# Altium project MainBoard.PrjPcb
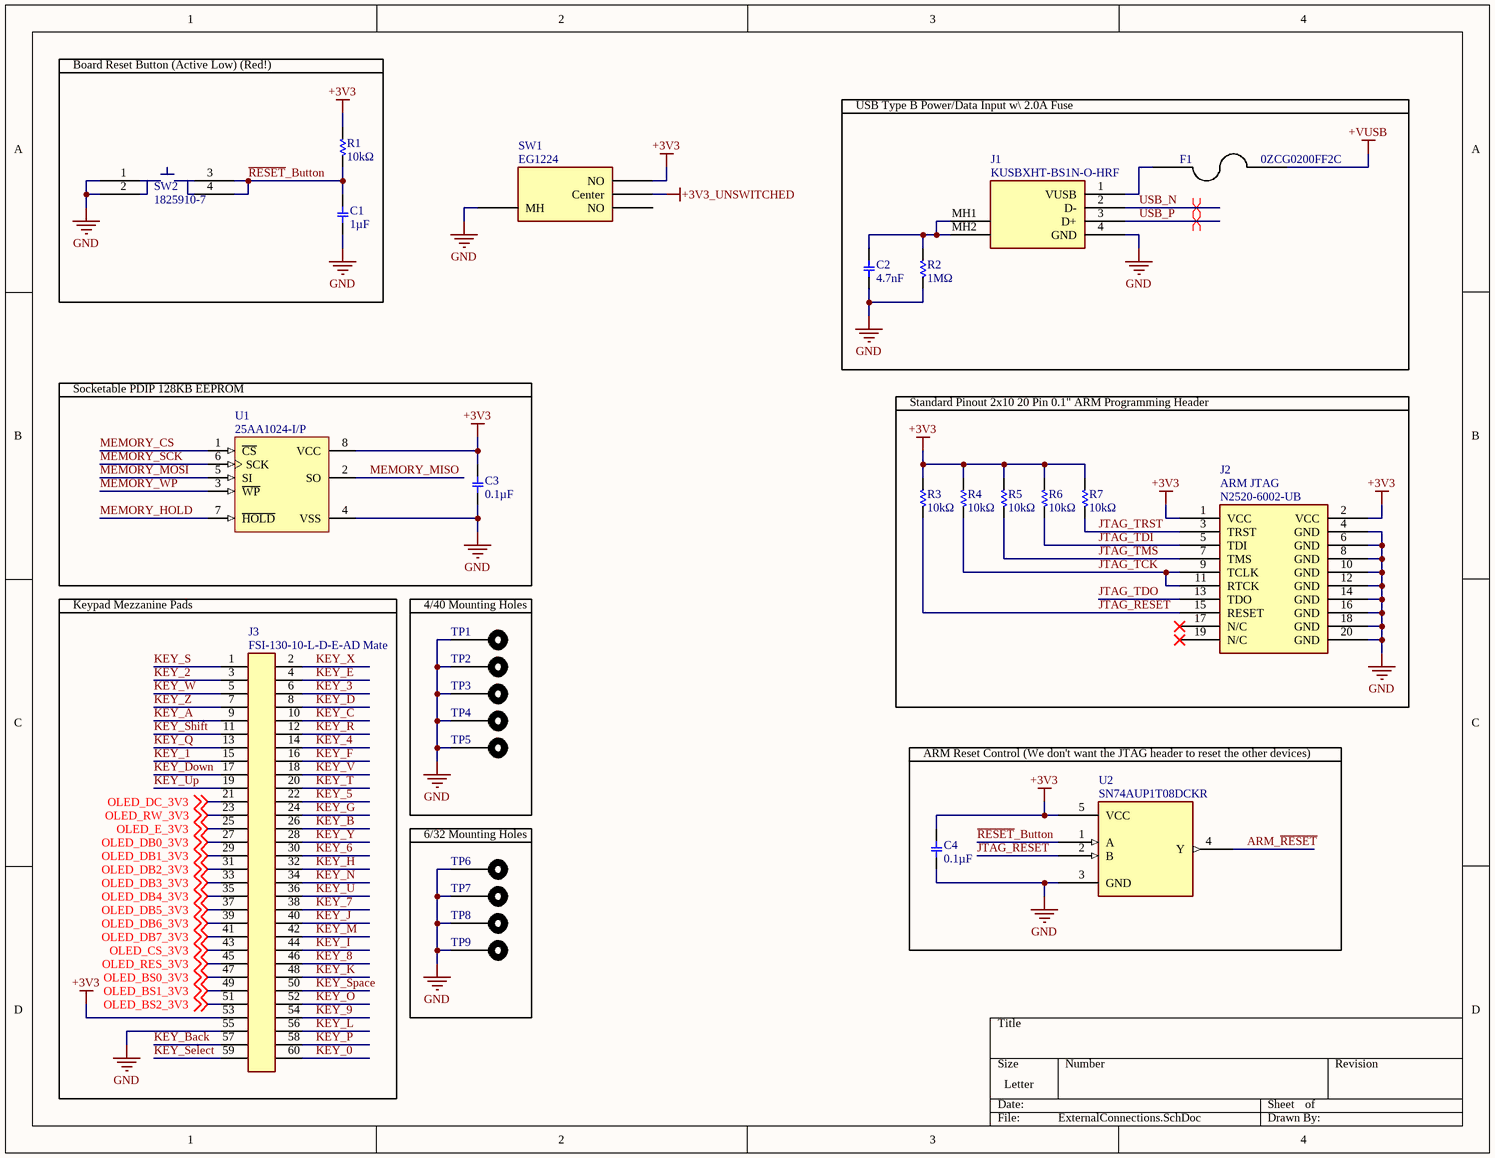
[diagram p0: ExternalConnections.SchDoc]
4 sheets, 88 parts. Net scope: global (net labels, ports and power ports of the same name join across sheets).
Board file: MainBoard.PcbDoc
Sheets:
  ExternalConnections.SchDoc
  USB.SchDoc
  Microcontroller.SchDoc
  Power.SchDoc

## Sheet ExternalConnections.SchDoc
size Letter

### Parts
C1  1µF  [C0805(2012)_NP_med]
C2  4.7nF  [C0805(2012)_NP_med]
C3  0.1µF  [C0805(2012)_NP_med]
C4  0.1µF  [C0805(2012)_NP_med]
F1  Manufacturer Part Number: 0ZCG0200FF2C  [C1812(4532)_NP_med]  (hidden comment: Bel 0ZCG0200FF2C)
J1  KUSBXHT-BS1N-O-HRF  [Kycon KUSBXHT-BS1N-O-HRF]
J2  ARM JTAG  Manufacturer Part Number: N2520-6002-UB  [3M 2520-6002UB]
J3  FSI-130-10-L-D-E-AD Mate  [FSI-130-10-L-D-E-AD - Mate]  (no BOM)
R1  10kΩ  [R0805(2012)_med]
R2  1MΩ  [R0805(2012)_med]
R3  10kΩ  [R0805(2012)_med]
R4  10kΩ  [R0805(2012)_med]
R5  10kΩ  [R0805(2012)_med]
R6  10kΩ  [R0805(2012)_med]
R7  10kΩ  [R0805(2012)_med]
SW1  Manufacturer Part Number: EG1224  [E-Switch EG1224]  (hidden comment: E-Switch EG1224)
SW2  1825910-7  [TE 1825910-6]
TP1  Testpoint  [4-40 HOLE]  (value not drawn)
TP2  Testpoint  [4-40 HOLE]  (value not drawn)
TP3  Testpoint  [4-40 HOLE]  (value not drawn)
TP4  Testpoint  [4-40 HOLE]  (value not drawn)
TP5  Testpoint  [4-40 HOLE]  (value not drawn)
TP6  Testpoint  [6-32 Hole]  (value not drawn)
TP7  Testpoint  [6-32 Hole]  (value not drawn)
TP8  Testpoint  [6-32 Hole]  (value not drawn)
TP9  Testpoint  [6-32 Hole]  (value not drawn)
U1  25AA1024-I/P  [PDIP300-P8]
U2  Manufacturer Part Number: SN74AUP1T08DCKR  [TI 5 Pin DCK (R-PDSO-G5)]  (hidden comment: TI SN74AUP1T08DCKR)

### Blocks framed on the sheet
Board Reset Button (Active Low) (Red!): C1 R1 SW2
USB Type B Power/Data Input w\ 2.0A Fuse: C2 F1 J1 R2
Socketable PDIP 128KB EEPROM: C3 U1
Standard Pinout 2x10 20 Pin 0.1" ARM Programming Header: J2 R3-R7
Keypad Mezzanine Pads: J3
4/40 Mounting Holes: TP1-TP5
6/32 Mounting Holes: TP6-TP9

### Nets
+3V3: C3.1 C4.1 J2.1(VCC) J2.2(VCC) J3.53 R1.1 R3.1 R4.1 R5.1 R6.1 R7.1 SW1.1(NO) U1.8(VCC) U2.5(VCC)
+3V3_UNSWITCHED: SW1.2(Center)
+VUSB: F1.2
GND: C1.2 C2.2 C3.2 C4.2 J1.4(GND) J2.4(GND) J2.6(GND) J2.8(GND) J2.10(GND) J2.12(GND) J2.14(GND) J2.16(GND) J2.18(GND) J2.20(GND) J3.55 R2.2 SW1.4(MH) SW2.1 SW2.2 TP1.1 TP2.1 TP3.1 TP4.1 TP5.1 TP6.1 TP7.1 TP8.1 TP9.1 U1.4(VSS) U2.3(GND)
ARM_~{RESET}: U2.4(Y)
JTAG_~{RESET}: J2.15(RESET) R3.2 U2.2(B)
JTAG_TCK: J2.9(TCLK) J2.11(RTCK) R4.2
JTAG_TDI: J2.5(TDI) R6.2
JTAG_TDO: J2.13(TDO)
JTAG_TMS: J2.7(TMS) R5.2
JTAG_TRST: J2.3(TRST) R7.2
KEY_0: J3.60
KEY_1: J3.15
KEY_2: J3.3
KEY_3: J3.6
KEY_4: J3.14
KEY_5: J3.22
KEY_6: J3.30
KEY_7: J3.38
KEY_8: J3.46
KEY_9: J3.54
KEY_A: J3.9
KEY_B: J3.26
KEY_Back: J3.57
KEY_C: J3.10
KEY_D: J3.8
KEY_Down: J3.17
KEY_E: J3.4
KEY_F: J3.16
KEY_G: J3.24
KEY_H: J3.32
KEY_I: J3.44
KEY_J: J3.40
KEY_K: J3.48
KEY_L: J3.56
KEY_M: J3.42
KEY_N: J3.34
KEY_O: J3.52
KEY_P: J3.58
KEY_Q: J3.13
KEY_R: J3.12
KEY_S: J3.1
KEY_Select: J3.59
KEY_Shift: J3.11
KEY_Space: J3.50
KEY_T: J3.20
KEY_U: J3.36
KEY_Up: J3.19
KEY_V: J3.18
KEY_W: J3.5
KEY_X: J3.2
KEY_Y: J3.28
KEY_Z: J3.7
MEMORY_CS: U1.1(~{CS})
MEMORY_HOLD: U1.7(~{HOLD})
MEMORY_MISO: U1.2(SO)
MEMORY_MOSI: U1.5(SI)
MEMORY_SCK: U1.6(SCK)
MEMORY_WP: U1.3(~{WP})
OLED_BS0_3V3: J3.47 ; off-sheet OLED_BS0_3V3
OLED_BS1_3V3: J3.49 ; off-sheet OLED_BS1_3V3
OLED_BS2_3V3: J3.51 ; off-sheet OLED_BS2_3V3
OLED_CS_3V3: J3.43 ; off-sheet OLED_CS_3V3
OLED_DB0_3V3: J3.27 ; off-sheet OLED_DB0_3V3
OLED_DB1_3V3: J3.29 ; off-sheet OLED_DB1_3V3
OLED_DB2_3V3: J3.31 ; off-sheet OLED_DB2_3V3
OLED_DB3_3V3: J3.33 ; off-sheet OLED_DB3_3V3
OLED_DB4_3V3: J3.35 ; off-sheet OLED_DB4_3V3
OLED_DB5_3V3: J3.37 ; off-sheet OLED_DB5_3V3
OLED_DB6_3V3: J3.39 ; off-sheet OLED_DB6_3V3
OLED_DB7_3V3: J3.41 ; off-sheet OLED_DB7_3V3
OLED_DC_3V3: J3.21 ; off-sheet OLED_DC_3V3
OLED_E_3V3: J3.25 ; off-sheet OLED_E_3V3
OLED_RES_3V3: J3.45 ; off-sheet OLED_RES_3V3
OLED_RW_3V3: J3.23 ; off-sheet OLED_RW_3V3
~{RESET}_Button: C1.1 R1.2 SW2.3 SW2.4 U2.1(A)
USB_N: J1.2(D-)
USB_P: J1.3(D+)
NetC2_1: C2.1 J1.MH1 J1.MH2 R2.1
NetF1_1: F1.1 J1.1(VUSB)

Not connected (* = marked no-connect by the designer): J2 17(N/C)* 19(N/C)*; SW1 3(NO)

### Layout directives
differential pair: USB_N, USB_P

### Notes on the sheet
- ARM Reset Control (We don't want the JTAG header to reset the other devices)

### Library data of the parts
C1-C4 = CPN_SMT: SMT Capacitor; Tolerance: X7R; Rating: 16v
  C1: Value: 1µF
  C2: Value: 4.7nF
  C3 C4: Value: 0.1µF
F1 = Bel 0ZCG0200FF2C: PTC RESTTBLE 2.0A 8V CHIP 1812; Manufacturer: Bel Fuse Inc.; Current - Max: 100A; Current - Hold (Ih) (Max): 2A; Current - Trip (It): 3.5A; R Min/Max: 0.020 ~ 0.070 Ohm; Time to Trip: 2s; Supplier 1: Digi-Key; RoHS: RoHS Compliant; Category: Circuit Protection; Stock 1: 4721; Pricing 1: 1=0.18, 10=0.169, 25=0.156, 100=0.1401, 250=0.12476, 500=0.10396, 1000=0.09851 (USD); Packaging: Cut Tape (CT); Voltage - Max: 8V; Package / Case: 1812 (4532 Metric), Concave; ComponentLink1URL: http://www.belfuse.com/pdfs/0ZCG.pdf; ComponentLink1Description: http://www.belfuse.com/pdfs/0ZCG.pdf; Supplier Part Number 1: 507-1777-1-ND
J1 = Kycon KUSBXHT-BS1N-O-HRF: TYPE B ORANGE HIGH TEMP/RETENTION; Manufacturer: Kycon; Connector Type: USB Type B Receptacle; Current Rating: 1 A; Gender: Female; Mounting Angle: Right; Number of Contacts: 4 Contact; Voltage Rating: 30 VAC; Number of Ports: 1 Port; Insulation Resistance: 1000 MOhms; Supplier 1: Mouser; Manufacturer Part Number: KUSBXHT-BS1N-O-HRF; RoHS: RoHS Compliant; Category: USB Connectors; Stock 1: 2882; Pricing 1: 1=2.06, 25=1.73, 100=1.51, 500=1.34, 1000=1.20, 5000=1.11, 10000=1.02 (USD); Color: Orange; Contact Plating: Gold; Operating Temperature Range: - 25 C to + 80 C; Packaging: Tray; Product: USB Type B Connectors; Series: KUSBXHT; Termination Style: Solder; Brand: Kycon; Contact Material: Phosphor Bronze; Flammability Rating: UL 94 V-0; Insulator Color: Orange; Product Category: USB Connectors; Standard: USB; Standard Pack Qty: 36; RoHS - Mouser: Y; Minimum Order Quantity: 1; Reeling: False; ComponentLink1URL: http://www.mouser.com/ds/2/222/KUSBX-371999.pdf; ComponentLink1Description: http://www.mouser.com/ds/2/222/KUSBX-371999.pdf
J2 = 20-Pin ARM JTAG Programming Header: Standard 20-Pin Pinout; Manufacturer: 3M; Connector Type: Header, Shrouded; Number of Positions: 20; Number of Positions Loaded: All; Pitch: 0.100" (2.54mm); Supplier 1: Digi-Key; RoHS: RoHS Compliant; Category: Connectors, Interconnects; Stock 1: 0; Pricing 1: 1008=2.059 (USD); Packaging: Bulk; Contact Type: Male Pin; Number of Rows: 2; Row Spacing: 0.100" (2.54mm); Contact Mating Length: 0.243" (6.17mm); Mounting Type: Through Hole; Termination: Solder; Fastening Type: -; Features: -; Contact Finish: Gold; Contact Finish Thickness: 30µin (0.76µm); Color: Black; ComponentLink1URL: http://multimedia.3m.com/mws/mediawebserver?66666UuZjcFSLXTtMXM6MxfcEVuQEcuZgVs6EVs6E666666--; ComponentLink1Description: http://multimedia.3m.com/mws/mediawebserver?66666UuZjcFSLXTtMXM6MxfcEVuQEcuZgVs6EVs6E666666--
J3 = Samtec FSI-130-10-L-D-E-AD Mate: CONN INTERFACE ONE PC 1MM 60POS
R1-R7 = RES_SMT: SMT resistor; Tolerance: 1%
  R1 R3-R7: Value: 10kΩ
  R2: Value: 1MΩ
SW1 = E-Switch EG1224: SWITCH SLIDE SPDT 500MA 15V; Contact Timing: Non-Shorting (BBM); Switch Function: On-On; Current Rating: 500mA (DC); Actuator Type: Standard; Actuator Length: 8.50mm; Switch Travel: 4.00mm; Operating Force: 250gf; Supplier 1: Digi-Key; Manufacturer: E-Switch; RoHS: RoHS Compliant; Category: Switches; Stock 1: 3595; Pricing 1: 1=0.73, 10=0.698, 25=0.684, 50=0.6112, 100=0.582, 250=0.56744, 500=0.48016, 1000=0.4656 (USD); Packaging: Bulk; Circuit: SPDT; Voltage Rating - AC: -; Voltage Rating - DC: 15V; Contact Material: Copper Alloy; Contact Finish: Silver; Mounting Type: Through Hole, Right Angle; Termination Style: PC Pin; Features: -; Actuator Material: -; Operating Temperature: -20°C ~ 70°C; Mechanical Life: -; Electrical Life: -; ComponentLink1URL: http://spec_sheets.e-switch.com/specs/P040042.pdf; ComponentLink1Description: http://spec_sheets.e-switch.com/specs/P040042.pdf; Supplier Part Number 1: EG2585-ND
SW2 = TE 1825910-6: SWITCH TACTILE SPST-NO 0.05A 24V; Manufacturer: TE Connectivity Alcoswitch Switches; Switch Function: Off-Mom; Contact Rating @ Voltage: 0.05A @ 24VDC; Actuator Type: Standard; Actuator Height off PCB, from Pins: 5.00mm; Actuator Orientation: Top Actuated; Outline: 6.00mm x 6.00mm; Illumination: Non-Illuminated; Operating Force: 160gf; Actuator Material: Polybutylene Terephthalate (PBT); Switch Travel: 0.25mm; Mechanical Life: 100,000 Cycles; Supplier 1: Digi-Key; Manufacturer Part Number: 1825910-6; RoHS: RoHS Compliant; Category: Switches; Stock 1: 68158; Pricing 1: 1=0.11, 25=0.1012, 50=0.0912, 100=0.0869, 250=0.08028, 500=0.07698, 1000=0.06268, 2000=0.05609, 5000=0.05278 (USD); Packaging: Bulk; Circuit: SPST-NO; Mounting Type: Through Hole; Termination Style: PC Pin; Illumination Voltage (Nominal): -; Illumination Type, Color: -; Ingress Protection: -; Features: -; Operating Temperature: -35°C ~ 85°C; ComponentLink1URL: http://www.te.com/commerce/DocumentDelivery/DDEController?Action=srchrtrv&DocNm=1825910&DocType=Customer+Drawing&DocLang=English; ComponentLink1Description: http://www.te.com/commerce/DocumentDelivery/DDEController?Action=srchrtrv&DocNm=1825910&DocType=Customer+Drawing&DocLang=English
U1 = 25AA1024-I/P: 1 Mbit SPI Bus Serial EEPROM, 8-Pin PDIP, Industrial Temperature; Manufacturer: Microchip; DatasheetVersion: revF, May-2008; PackageVersion: revBB, Aug-2009; PackageReference: PDIP300-P8; PackageDescription: 8-Lead Plastic Dual In-Line (P) - 300 mil Body [PDIP]; Supplier 1: Digi-Key; Supplier Part Number 1: 25AA1024-I/P-ND; Supplier 2: Farnell; Supplier Part Number 2: 1548441; Supplier 3: Newark; Supplier Part Number 3: 89H3144; Supplier 4: Mouser; Supplier Part Number 4: 579-25AA1024-I/P; Mounting Technology: Through Hole; Code_JEDEC: MS-001; PartNumber: 25AA1024-I/P; ComponentLink1Description: Manufacturer URL; ComponentLink1URL: http://www.microchip.com/; ComponentLink2Description: Datasheet; ComponentLink2URL: http://ww1.microchip.com/downloads/en/DeviceDoc/21836F.pdf; ComponentLink3Description: Package Specification; ComponentLink3URL: http://www.microchip.com/stellent/groups/techpub_sg/documents/packagingspec/en012702.pdf
U2 = TI SN74AUP1T08DCKR: IC GATE AND 1CH 2-INP SC-70-5; Manufacturer: Texas Instruments; Logic Type: AND Gate; Number of Circuits: 1; Number of Inputs: 2; Voltage - Supply: 2.3 V ~ 3.6 V; Current - Quiescent (Max): 0.5µA; Current - Output High, Low: 4mA, 4mA; Logic Level - Low: 0.35 V ~ 0.5 V; Logic Level - High: 1.1 V ~ 1.19 V; Max Propagation Delay @ V, Max CL: 4.4ns @ 3.3V, 30pF; Supplier 1: Digi-Key; RoHS: RoHS Compliant; Category: Integrated Circuits (ICs); Stock 1: 3783; Pricing 1: 1=0.36, 10=0.29, 100=0.198, 500=0.1482, 1000=0.111 (USD); Packaging: Cut Tape (CT); Features: Schmitt Trigger; Operating Temperature: -40°C ~ 85°C; Mounting Type: Surface Mount; Supplier Device Package: SC-70-5; Package / Case: 5-TSSOP, SC-70-5, SOT-353; ComponentLink1URL: http://www.ti.com/lit/ds/symlink/sn74aup1t08.pdf; ComponentLink1Description: http://www.ti.com/lit/ds/symlink/sn74aup1t08.pdf; Supplier Part Number 1: 296-27391-1-ND

## Sheet USB.SchDoc
size Letter
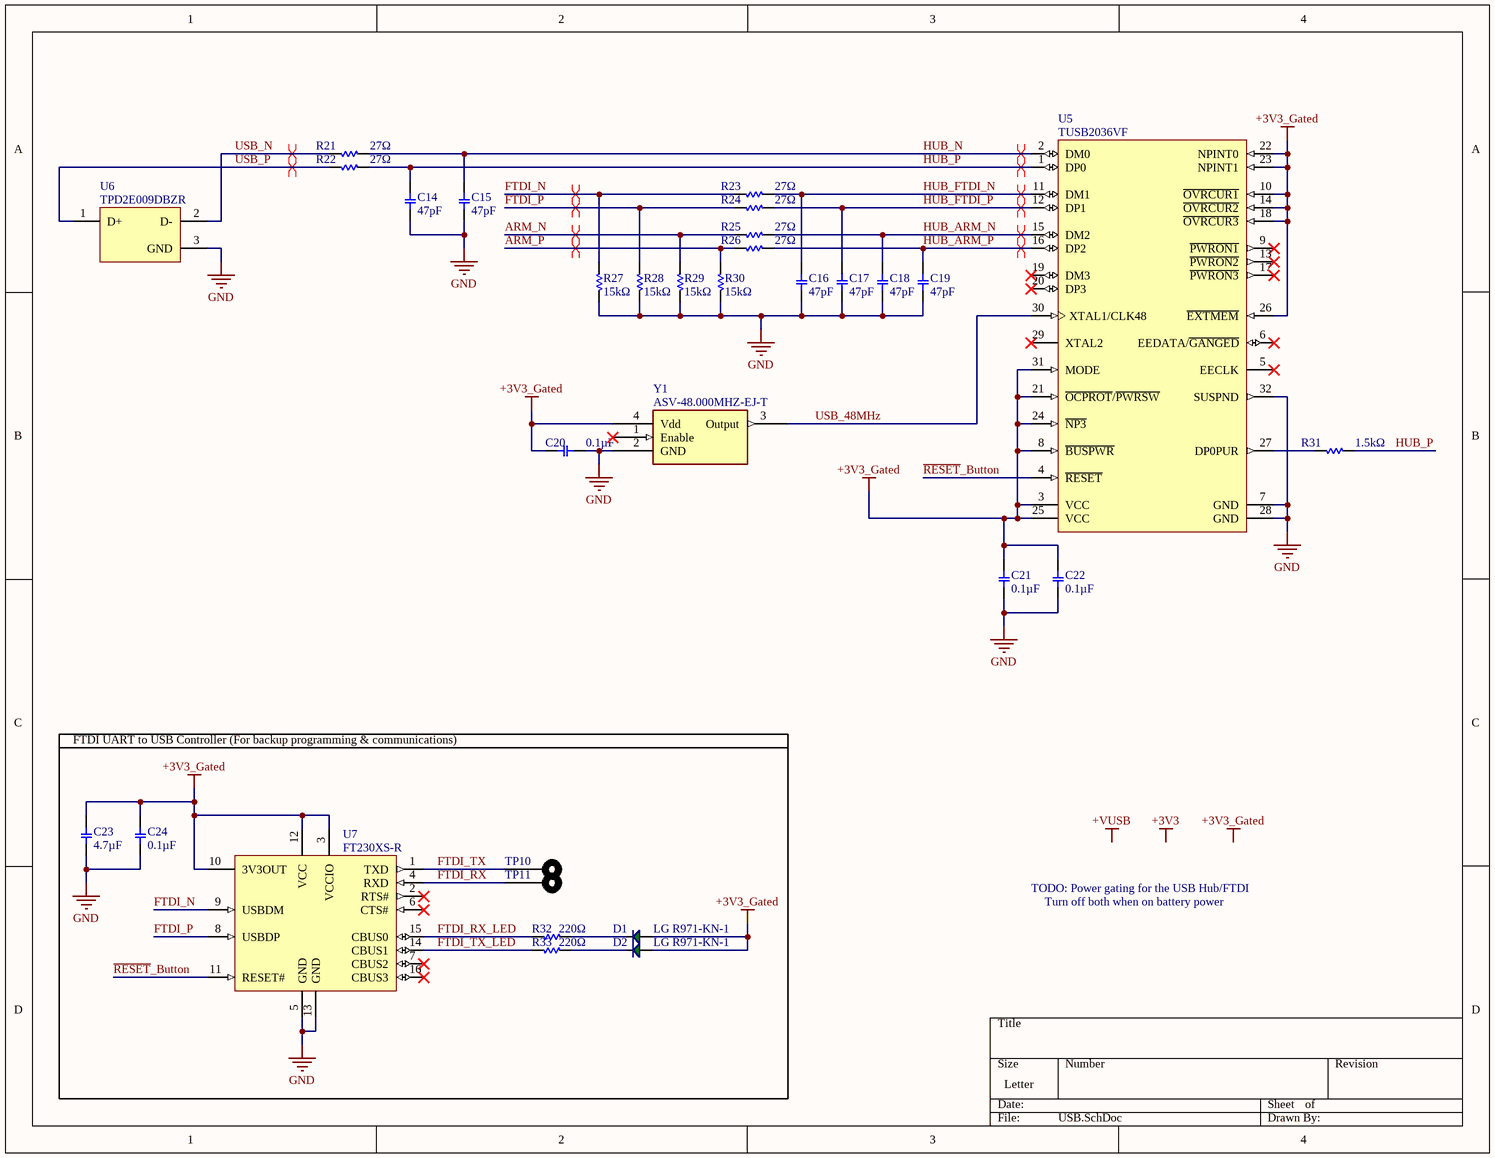
[diagram p1: USB.SchDoc]

### Parts
C14  47pF  [C0805(2012)_NP_med]
C15  47pF  [C0805(2012)_NP_med]
C16  47pF  [C0805(2012)_NP_med]
C17  47pF  [C0805(2012)_NP_med]
C18  47pF  [C0805(2012)_NP_med]
C19  47pF  [C0805(2012)_NP_med]
C20  0.1µF  [C0805(2012)_NP_med]
C21  0.1µF  [C0805(2012)_NP_med]
C22  0.1µF  [C0805(2012)_NP_med]
C23  4.7µF  [C0805(2012)_NP_med]
C24  0.1µF  [C0805(2012)_NP_med]
D1  LG R971-KN-1  [C0805(2012)_P_med]
D2  LG R971-KN-1  [C0805(2012)_P_med]
R21  27Ω  [R0805(2012)_med]
R22  27Ω  [R0805(2012)_med]
R23  27Ω  [R0805(2012)_med]
R24  27Ω  [R0805(2012)_med]
R25  27Ω  [R0805(2012)_med]
R26  27Ω  [R0805(2012)_med]
R27  15kΩ  [R0805(2012)_med]
R28  15kΩ  [R0805(2012)_med]
R29  15kΩ  [R0805(2012)_med]
R30  15kΩ  [R0805(2012)_med]
R31  1.5kΩ  [R0805(2012)_med]
R32  220Ω  [R0805(2012)_med]
R33  220Ω  [R0805(2012)_med]
TP10  Testpoint  [TESTPOINT]  (value not drawn)
TP11  Testpoint  [TESTPOINT]  (value not drawn)
U5  TUSB2036VF  [VF32_M]
U6  TPD2E009DBZR  [DBZ3_N]
U7  FT230XS-R  [SSOP-16_M]
Y1  ASV-48.000MHZ-EJ-T  [Abracon ASV XO]

### Nets
+3V3_Gated: C20.1 C21.1 C22.1 C23.1 C24.1 D1.2(A) D2.2(A) U5.3(VCC) U5.8(~{BUSPWR}) U5.10(~{OVRCUR1}) U5.14(~{OVRCUR2}) U5.18(~{OVRCUR3}) U5.21(~{OCPROT}/~{PWRSW}) U5.22(NPINT0) U5.23(NPINT1) U5.24(~{NP3}) U5.25(VCC) U5.26(~{EXTMEM}) U5.31(MODE) U7.3(VCCIO) U7.10(3V3OUT) U7.12(VCC) Y1.4(Vdd)
GND: C14.2 C15.2 C16.2 C17.2 C18.2 C19.2 C20.2 C21.2 C22.2 C23.2 C24.2 R27.1 R28.1 R29.1 R30.1 U5.7(GND) U5.28(GND) U5.32(SUSPND) U6.3(GND) U7.5(GND) U7.13(GND) Y1.2(GND)
ARM_N: R25.1 R29.2
ARM_P: R26.1 R30.2
FTDI_N: R23.1 R27.2 U7.9(USBDM)
FTDI_P: R24.1 R28.2 U7.8(USBDP)
FTDI_RX: TP11.1 U7.4(RXD)
FTDI_RX_LED: R32.2 U7.15(CBUS0)
FTDI_TX: TP10.1 U7.1(TXD)
FTDI_TX_LED: R33.2 U7.14(CBUS1)
HUB_ARM_N: C18.1 R25.2 U5.15(DM2)
HUB_ARM_P: C19.1 R26.2 U5.16(DP2)
HUB_FTDI_N: C16.1 R23.2 U5.11(DM1)
HUB_FTDI_P: C17.1 R24.2 U5.12(DP1)
HUB_N: C15.1 R21.2 U5.2(DM0)
HUB_P: C14.1 R22.2 R31.2 U5.1(DP0)
~{RESET}_Button: U5.4(~{RESET}) U7.11(RESET#)
USB_48MHz: U5.30(XTAL1/CLK48) Y1.3(Output)
USB_N: R21.1 U6.2(D-)
USB_P: R22.1 U6.1(D+)
NetD1_1: D1.1(K) R32.1
NetD2_1: D2.1(K) R33.1
NetR31_1: R31.1 U5.27(DP0PUR)

Not connected (* = marked no-connect by the designer): U5 5(EECLK)* 6(EEDATA/~{GANGED})* 9(~{PWRON1})* 13(~{PWRON2})* 17(~{PWRON3})* 19(DM3)* 20(DP3)* 29(XTAL2)*; U7 2(RTS#)* 6(CTS#)* 7(CBUS2)* 16(CBUS3)*; Y1 1(Enable)*

### Layout directives
differential pair: ARM_N, ARM_P, FTDI_N, FTDI_P, HUB_ARM_N, HUB_ARM_P, HUB_FTDI_N, HUB_FTDI_P, HUB_N, HUB_P, USB_N, USB_P

### Notes on the sheet
- FTDI UART to USB Controller (For backup programming & communications)
- TODO: Power gating for the USB Hub/FTDI
- Turn off both when on battery power
- Labels drawn without touching a wire or pin: +3V3, +3V3_Gated, +VUSB

### Library data of the parts
C14-C24 = CPN_SMT: as C1 on sheet ExternalConnections
  C14-C19: Value: 47pF
  C20-C22 C24: Value: 0.1µF
  C23: Value: 4.7µF
D1 D2 = DIODE_sMT: SMT LED; Manufacturer: AVX; Part Number: SD0805S020S1R0; Digikey #: 478-7800-1-ND
R21-R33 = RES_SMT: SMT resistor; Tolerance: 1%
  R21-R26: Value: 27Ω
  R27-R30: Value: 15kΩ
  R31: Value: 1.5kΩ
  R32 R33: Value: 220Ω
TP10 TP11 = Testpoint: A single hole in the board
U5 = TUSB2036VF: 2 / 3-Port Hub for USB with Optional Serial EEPROM Interface, 3.3V, 0 to 70 degC, 32-Pin LQFP (VF), Green (RoHS & no Sb/Br); Manufacturer: Texas Instruments; SubFamily: USB Hub Controller; USB Speed: Full; USB Full Speed: True; Supply Voltage(s)(V): 3.3; DatasheetVersion: SLLS372E; PackageVersion: revD, Apr-2000; PackageReference: VF32; PackageDescription: 32-Pin Plastic Quad Flatpack, 7 x 7 mm Body, 0.8 mm Pitch; PartNumber: TUSB2036VF; Mounting Technology: Surface Mount; Eco-Plan: Green (RoHS & no Sb/Br); Integrated MCU Architecture: N/A; ComponentLink1Description: Datasheet; ComponentLink1URL: http://www.ti.com/general/docs/lit/getliterature.tsp?genericPartNumber=TUSB2036&fileType=pdf; ComponentLink2Description: Package Specification; ComponentLink2URL: http://www.ti.com/litv/pdf/mtqf002b
U6 = TPD2E009DBZR: ESD Protection Array for High-Speed Data Interfaces, 2 Channels, -40 to +85 degC, 3-pin SOT-23 (DBZ), Green (RoHS & no Sb/Br); Manufacturer: Texas Instruments; Breakdown Voltage(Min)(V): 9; Differential Capacitance(pF): 0.01; IEC 61000-4-2 Air-Gap(+/- kV): 8; IO Capacitance(Typ)(pF): 0.7; IO Leakage Current(nA): 10; Serial ATA / eSATA: TRUE; SubFamily: ESD Solution; DatasheetVersion: SLVS953A; PackageVersion: revB, Apr-2005; PackageReference: DBZ3; PackageDescription: 3-Pin Plastic Small-Outline Package, 0.95 mm Pitch, 2.4 mm Lead Span; Supplier 1: Digi-Key; Supplier Part Number 1: 296-24657-2-ND; Supplier 2: Digi-Key; Supplier Part Number 2: 296-24657-1-ND; Supplier 3: Digi-Key; Supplier Part Number 3: 296-24657-6-ND; Supplier 4: Farnell; Supplier Part Number 4: 1755715RL; Supplier 5: Farnell; Supplier Part Number 5: 1755715; Supplier 6: Newark; Supplier Part Number 6: 14R9549; Supplier 7: Mouser; Supplier Part Number 7: 595-TPD2E009DBZR; Eco-Plan: Green (RoHS & no Sb/Br); IEC 61000-4-2 Contact(+/- kV): 8; Mounting Technology: Surface Mount; Code_JEDEC: TO-236-AB; PartNumber: TPD2E009DBZR; ComponentLink1Description: Datasheet; ComponentLink1URL: http://www.ti.com/general/docs/lit/getliterature.tsp?genericPartNumber=TPD2E009&fileType=pdf; ComponentLink2Description: URL Link1; ComponentLink2URL: SamplesURL:http://www.ti.com/product/tpd2e009#samples
U7 = FT230XS-R: USB to Basic UART Interface Chip, UHCI/OHCI/EHCI Compatible, USB 2.0 Compatible, -40 to +85 degC, 16-Pin SSOP, Pb-Free, Tape and Reel; Manufacturer: FTDI; DatasheetVersion: ver 1.2, Feb-2013; PackageVersion: Feb-13; PackageReference: SSOP-16; PackageDescription: 16-Pin Small Outline Package, 8.6 x 3.9 mm Body, 0.635 mm Pitch; Code_JEDEC: MO-137-AB; PartNumber: FT230XS-R; ComponentLink1Description: Manufacturer URL; ComponentLink1URL: http://www.ftdichip.com/; ComponentLink2Description: Datasheet; ComponentLink2URL: http://www.ftdichip.com/Support/Documents/DataSheets/ICs/DS_FT230X.pdf; ComponentLink3Description: FT230X Product Page; ComponentLink3URL: www.ftdichip.com/Products/ICs/FT230X.html
Y1 = Abacrom ASV Series: OSC XO X.000MHZ HCMOS SMD

## Sheet Microcontroller.SchDoc
size Letter
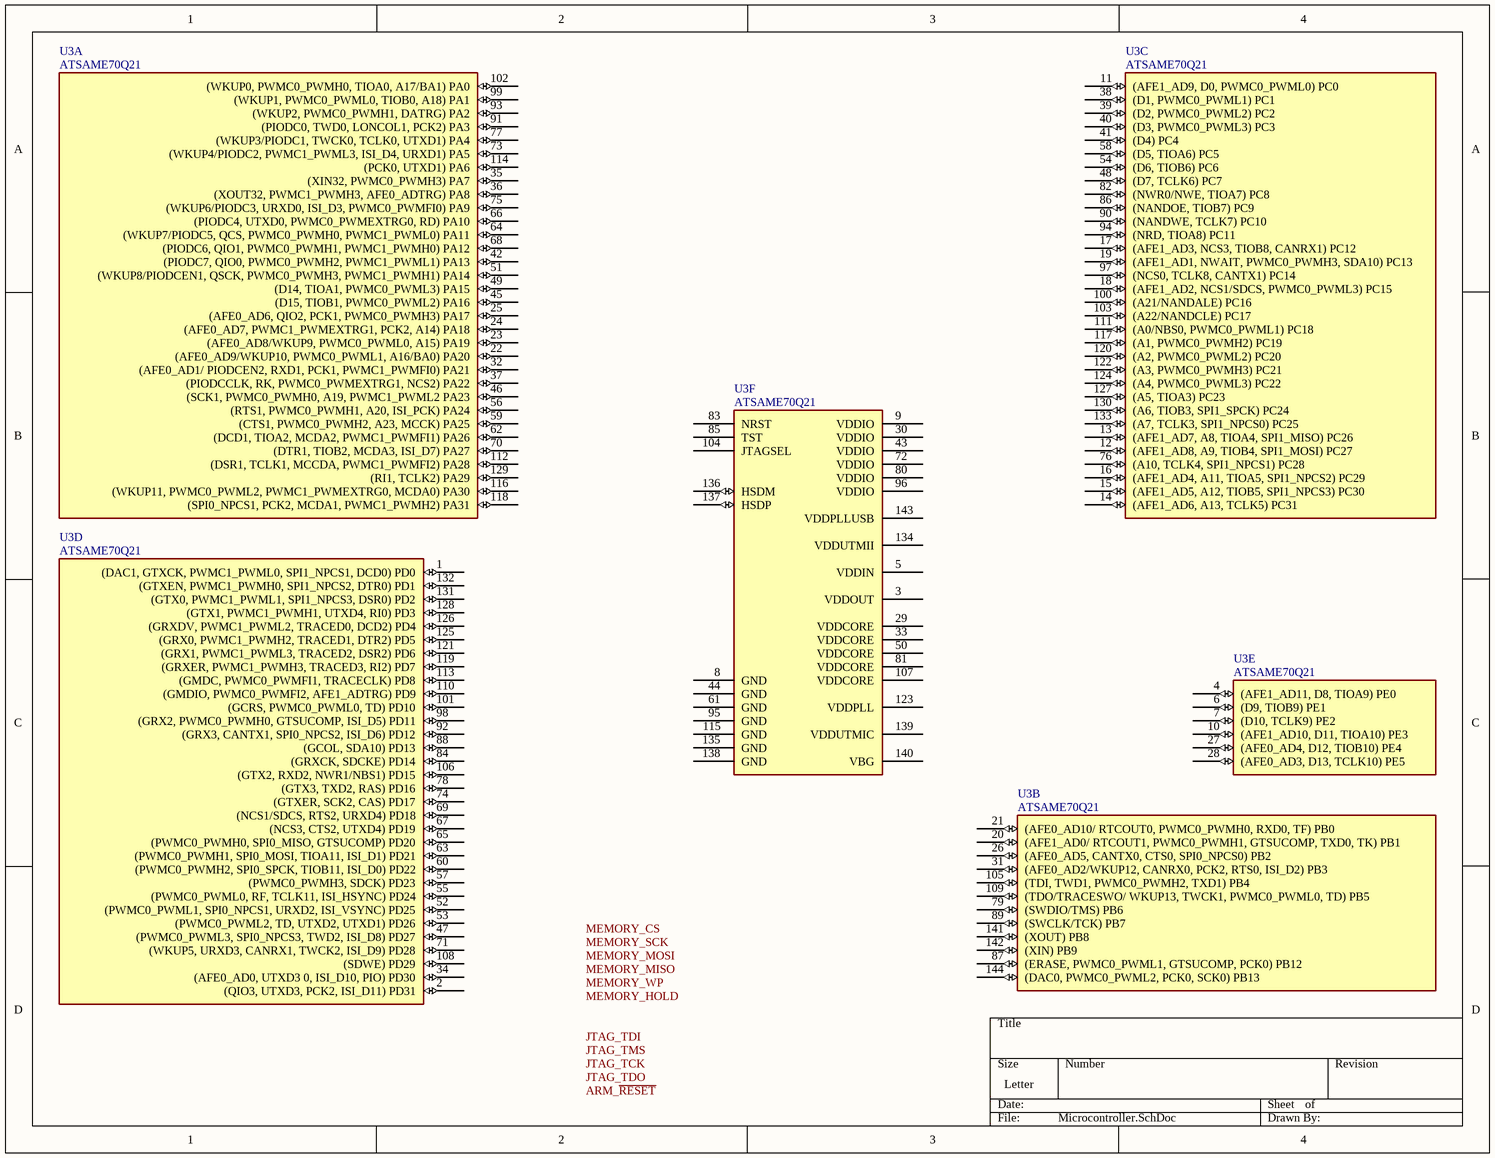
[diagram p2: Microcontroller.SchDoc]

### Parts
U3  ATSAME70Q21  [Atmel 144AA_M]  (parts A,B,C,D,E,F of 6)

### Nets

Not connected (* = marked no-connect by the designer): U3 1((DAC1,_GTXCK,_PWMC1_PWML0,_SPI1_NPCS1,_DCD0)_PD0) 2((QIO3,_UTXD3,_PCK2,_ISI_D11)_PD31) 3(VDDOUT) 4((AFE1_AD11,_D8,_TIOA9)_PE0) 5(VDDIN) 6((D9,_TIOB9)_PE1) 7((D10,_TCLK9)_PE2) 8(GND) 9(VDDIO) 10((AFE1_AD10,_D11,_TIOA10)_PE3) 11((AFE1_AD9,_D0,_PWMC0_PWML0)_PC0) 12((AFE1_AD8,_A9,_TIOB4,_SPI1_MOSI)_PC27) 13((AFE1_AD7,_A8,_TIOA4,_SPI1_MISO)_PC26) 14((AFE1_AD6,_A13,_TCLK5)_PC31) 15((AFE1_AD5,_A12,_TIOB5,_SPI1_NPCS3)_PC30) 16((AFE1_AD4,_A11,_TIOA5,_SPI1_NPCS2)_PC29) 17((AFE1_AD3,_NCS3,_TIOB8,_CANRX1)_PC12) 18((AFE1_AD2,_NCS1/SDCS,_PWMC0_PWML3)_PC15) 19((AFE1_AD1,_NWAIT,_PWMC0_PWMH3,_SDA10)_PC13) 20((AFE1_AD0/_RTCOUT1,_PWMC0_PWMH1,_GTSUCOMP,_TXD0,_TK)_PB1) 21((AFE0_AD10/_RTCOUT0,_PWMC0_PWMH0,_RXD0,_TF)_PB0) 22((AFE0_AD9/WKUP10,_PWMC0_PWML1,_A16/BA0)_PA20) 23((AFE0_AD8/WKUP9,_PWMC0_PWML0,_A15)_PA19) 24((AFE0_AD7,_PWMC1_PWMEXTRG1,_PCK2,_A14)_PA18) 25((AFE0_AD6,_QIO2,_PCK1,_PWMC0_PWMH3)_PA17) 26((AFE0_AD5,_CANTX0,_CTS0,_SPI0_NPCS0)_PB2) 27((AFE0_AD4,_D12,_TIOB10)_PE4) 28((AFE0_AD3,_D13,_TCLK10)_PE5) 29(VDDCORE) 30(VDDIO) 31((AFE0_AD2/WKUP12,_CANRX0,_PCK2,_RTS0,_ISI_D2)_PB3) 32((AFE0_AD1/_PIODCEN2,_RXD1,_PCK1,_PWMC1_PWMFI0)_PA21) 33(VDDCORE) 34((AFE0_AD0,_UTXD3_0,_ISI_D10,_PIO)_PD30) 35((XIN32,_PWMC0_PWMH3)_PA7) 36((XOUT32,_PWMC1_PWMH3,_AFE0_ADTRG)_PA8) 37((PIODCCLK,_RK,_PWMC0_PWMEXTRG1,_NCS2)_PA22) 38((D1,_PWMC0_PWML1)_PC1) 39((D2,_PWMC0_PWML2)_PC2) 40((D3,_PWMC0_PWML3)_PC3) 41((D4)_PC4) 42((PIODC7,_QIO0,_PWMC0_PWMH2,_PWMC1_PWML1)_PA13) 43(VDDIO) 44(GND) 45((D15,_TIOB1,_PWMC0_PWML2)_PA16) 46((SCK1,_PWMC0_PWMH0,_A19,_PWMC1_PWML2_PA23) 47((PWMC0_PWML3,_SPI0_NPCS3,_TWD2,_ISI_D8)_PD27) 48((D7,_TCLK6)_PC7) 49((D14,_TIOA1,_PWMC0_PWML3)_PA15) 50(VDDCORE) 51((WKUP8/PIODCEN1,_QSCK,_PWMC0_PWMH3,_PWMC1_PWMH1)_PA14) 52((PWMC0_PWML1,_SPI0_NPCS1,_URXD2,_ISI_VSYNC)_PD25) 53((PWMC0_PWML2,_TD,_UTXD2,_UTXD1)_PD26) 54((D6,_TIOB6)_PC6) 55((PWMC0_PWML0,_RF,_TCLK11,_ISI_HSYNC)_PD24) 56((RTS1,_PWMC0_PWMH1,_A20,_ISI_PCK)_PA24) 57((PWMC0_PWMH3,_SDCK)_PD23) 58((D5,_TIOA6)_PC5) 59((CTS1,_PWMC0_PWMH2,_A23,_MCCK)_PA25) 60((PWMC0_PWMH2,_SPI0_SPCK,_TIOB11,_ISI_D0)_PD22) 61(GND) 62((DCD1,_TIOA2,_MCDA2,_PWMC1_PWMFI1)_PA26) 63((PWMC0_PWMH1,_SPI0_MOSI,_TIOA11,_ISI_D1)_PD21) 64((WKUP7/PIODC5,_QCS,_PWMC0_PWMH0,_PWMC1_PWML0)_PA11) 65((PWMC0_PWMH0,_SPI0_MISO,_GTSUCOMP)_PD20) 66((PIODC4,_UTXD0,_PWMC0_PWMEXTRG0,_RD)_PA10) 67((NCS3,_CTS2,_UTXD4)_PD19) 68((PIODC6,_QIO1,_PWMC0_PWMH1,_PWMC1_PWMH0)_PA12) 69((NCS1/SDCS,_RTS2,_URXD4)_PD18) 70((DTR1,_TIOB2,_MCDA3,_ISI_D7)_PA27) 71((WKUP5,_URXD3,_CANRX1,_TWCK2,_ISI_D9)_PD28) 72(VDDIO) 73((WKUP4/PIODC2,_PWMC1_PWML3,_ISI_D4,_URXD1)_PA5) 74((GTXER,_SCK2,_CAS)_PD17) 75((WKUP6/PIODC3,_URXD0,_ISI_D3,_PWMC0_PWMFI0)_PA9) 76((A10,_TCLK4,_SPI1_NPCS1)_PC28) 77((WKUP3/PIODC1,_TWCK0,_TCLK0,_UTXD1)_PA4) 78((GTX3,_TXD2,_RAS)_PD16) 79((SWDIO/TMS)_PB6) 80(VDDIO) 81(VDDCORE) 82((NWR0/NWE,_TIOA7)_PC8) 83(NRST) 84((GRXCK,_SDCKE)_PD14) 85(TST) 86((NANDOE,_TIOB7)_PC9) 87((ERASE,_PWMC0_PWML1,_GTSUCOMP,_PCK0)_PB12) 88((GCOL,_SDA10)_PD13) 89((SWCLK/TCK)_PB7) 90((NANDWE,_TCLK7)_PC10) 91((PIODC0,_TWD0,_LONCOL1,_PCK2)_PA3) 92((GRX3,_CANTX1,_SPI0_NPCS2,_ISI_D6)_PD12) 93((WKUP2,_PWMC0_PWMH1,_DATRG)_PA2) 94((NRD,_TIOA8)_PC11) 95(GND) 96(VDDIO) 97((NCS0,_TCLK8,_CANTX1)_PC14) 98((GRX2,_PWMC0_PWMH0,_GTSUCOMP,_ISI_D5)_PD11) 99((WKUP1,_PWMC0_PWML0,_TIOB0,_A18)_PA1) 100((A21/NANDALE)_PC16) 101((GCRS,_PWMC0_PWML0,_TD)_PD10) 102((WKUP0,_PWMC0_PWMH0,_TIOA0,_A17/BA1)_PA0) 103((A22/NANDCLE)_PC17) 104(JTAGSEL) 105((TDI,_TWD1,_PWMC0_PWMH2,_TXD1)_PB4) 106((GTX2,_RXD2,_NWR1/NBS1)_PD15) 107(VDDCORE) 108((SDWE)_PD29) 109((TDO/TRACESWO/_WKUP13,_TWCK1,_PWMC0_PWML0,_TD)_PB5) 110((GMDIO,_PWMC0_PWMFI2,_AFE1_ADTRG)_PD9) 111((A0/NBS0,_PWMC0_PWML1)_PC18) 112((DSR1,_TCLK1,_MCCDA,_PWMC1_PWMFI2)_PA28) 113((GMDC,_PWMC0_PWMFI1,_TRACECLK)_PD8) 114((PCK0,_UTXD1)_PA6) 115(GND) 116((WKUP11,_PWMC0_PWML2,_PWMC1_PWMEXTRG0,_MCDA0)_PA30) 117((A1,_PWMC0_PWMH2)_PC19) 118((SPI0_NPCS1,_PCK2,_MCDA1,_PWMC1_PWMH2)_PA31) 119((GRXER,_PWMC1_PWMH3,_TRACED3,_RI2)_PD7) 120((A2,_PWMC0_PWML2)_PC20) 121((GRX1,_PWMC1_PWML3,_TRACED2,_DSR2)_PD6) 122((A3,_PWMC0_PWMH3)_PC21) 123(VDDPLL) 124((A4,_PWMC0_PWML3)_PC22) 125((GRX0,_PWMC1_PWMH2,_TRACED1,_DTR2)_PD5) 126((GRXDV,_PWMC1_PWML2,_TRACED0,_DCD2)_PD4) 127((A5,_TIOA3)_PC23) 128((GTX1,_PWMC1_PWMH1,_UTXD4,_RI0)_PD3) 129((RI1,_TCLK2)_PA29) 130((A6,_TIOB3,_SPI1_SPCK)_PC24) 131((GTX0,_PWMC1_PWML1,_SPI1_NPCS3,_DSR0)_PD2) 132((GTXEN,_PWMC1_PWMH0,_SPI1_NPCS2,_DTR0)_PD1) 133((A7,_TCLK3,_SPI1_NPCS0)_PC25) 134(VDDUTMII) 135(GND) 136(HSDM) 137(HSDP) 138(GND) 139(VDDUTMIC) 140(VBG) 141((XOUT)_PB8) 142((XIN)_PB9) 143(VDDPLLUSB) 144((DAC0,_PWMC0_PWML2,_PCK0,_SCK0)_PB13)

### Notes on the sheet
- Labels drawn without touching a wire or pin: ARM_~{RESET}, JTAG_TCK, JTAG_TDI, JTAG_TDO, JTAG_TMS, MEMORY_CS, MEMORY_HOLD, MEMORY_MISO, MEMORY_MOSI, MEMORY_SCK, MEMORY_WP

### Library data of the parts
U3 = Atmel SAME70Q21: IC MCU 32BIT 2048KB FLASH; Manufacturer: Atmel; Manufacturer Part Number: ATSAME70Q21A-AN; Core Processor: ARM® Cortex®-M7; Core Size: 32-Bit; Speed: 300MHz; Connectivity: CAN, EBI/EMI, Ethernet, I²C, IrDA, LIN, MMC/SD/SDIO, SPI, UART/USART, USB; Peripherals: Brown-out Detect/Reset, DMA, I²S, POR, PWM, WDT; Number of I/O: 114; Program Memory Size: 2MB (2M x 8); RAM Size: 384K x 8; Voltage - Supply (Vcc/Vdd): 1.62 V ~ 3.6 V; Data Converters: A/D 24x12b, D/A 2x12b; Oscillator Type: Internal; Supplier 1: Digi-Key; RoHS: RoHS Compliant; Category: Integrated Circuits (ICs); Stock 1: 346; Pricing 1: 1=19.29, 10=17.532, 100=14.9022, 250=13.58732, 500=12.7107, 1000=12.175 (USD); Packaging: Tray; Program Memory Type: FLASH; EEPROM Size: -; Operating Temperature: -40°C ~ 105°C; Package / Case: 144-LQFP; Supplier Device Package: 144-LQFP (20x20); ComponentLink1URL: http://www.atmel.com/Images/Atmel-11296-32-bit-Cortex-M7-Microcontroller-SAM-E70Q-SAM-E70N-SAM-E70J_Datasheet.pdf; ComponentLink1Description: http://www.atmel.com/Images/Atmel-11296-32-bit-Cortex-M7-Microcontroller-SAM-E70Q-SAM-E70N-SAM-E70J_Datasheet.pdf

## Sheet Power.SchDoc
size Letter
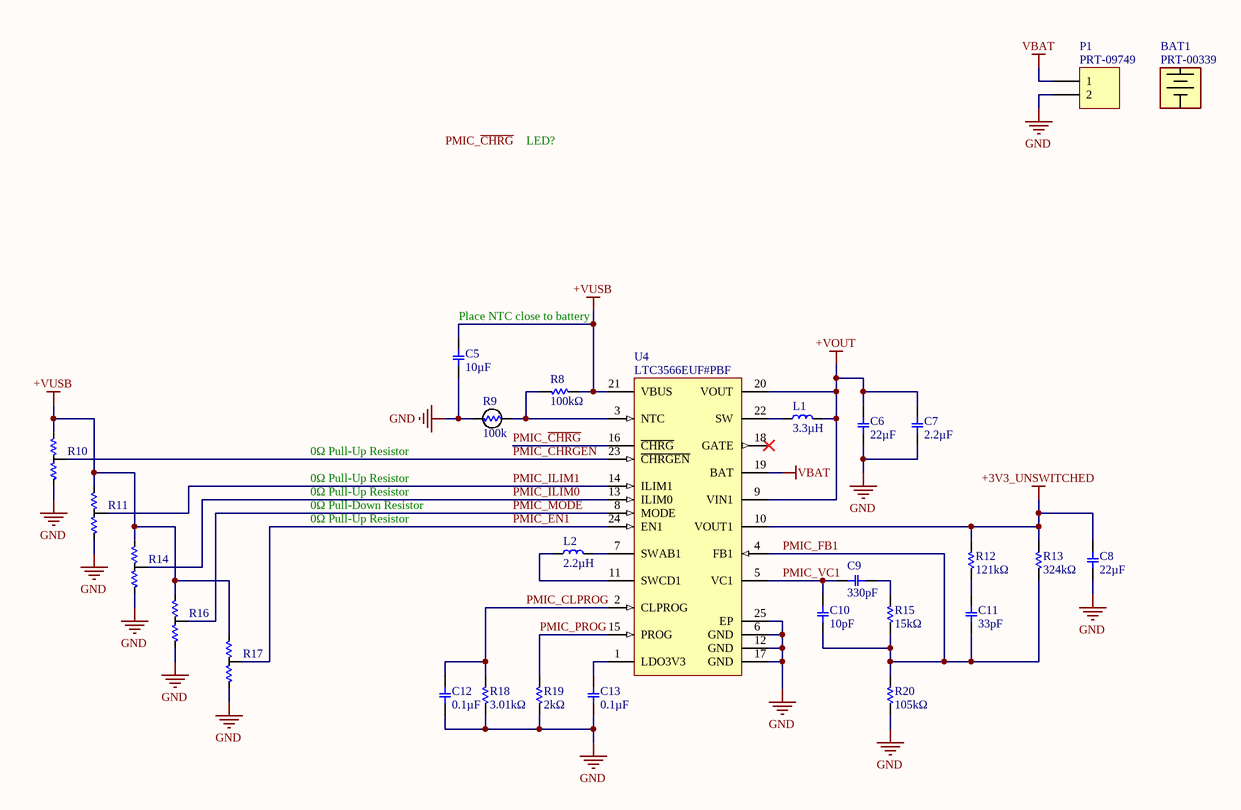
[diagram p3: Power.SchDoc]

### Parts
BAT1  PRT-00339  [LiPo Battery - 1000mA]
C5  10µF  [C0805(2012)_NP_med]
C6  22µF  [C0805(2012)_NP_med]
C7  2.2µF  [C0805(2012)_NP_med]
C8  22µF  [C0805(2012)_NP_med]
C9  330pF  [C0805(2012)_NP_med]
C10  10pF  [C0805(2012)_NP_med]
C11  33pF  [C0805(2012)_NP_med]
C12  0.1µF  [C0805(2012)_NP_med]
C13  0.1µF  [C0805(2012)_NP_med]
L1  Inductance: 3.3µH  [WURTH WE-TPC 4828]  (hidden comment: Wurth 744043003)
L2  Inductance: 2.2µH  [WURTH WE-TPC 4828]  (hidden comment: Wurth 7440430022)
P1  PRT-09749  [SPARKFUN PRT-09749]
R8  100kΩ  [R0805(2012)_med]
R9  Resistance in Ohms @ 25°C: 100k  [R0805(2012)_med]  (hidden comment: Vishay NTCS0805E3104FXT)
R10  0  [R0805(2012)_med_double]  (value not drawn)
R11  0  [R0805(2012)_med_double]  (value not drawn)
R12  121kΩ  [R0805(2012)_med]
R13  324kΩ  [R0805(2012)_med]
R14  0  [R0805(2012)_med_double]  (value not drawn)
R15  15kΩ  [R0805(2012)_med]
R16  0  [R0805(2012)_med_double]  (value not drawn)
R17  0  [R0805(2012)_med_double]  (value not drawn)
R18  3.01kΩ  [R0805(2012)_med]
R19  2kΩ  [R0805(2012)_med]
R20  105kΩ  [R0805(2012)_med]
U4  LTC3566EUF#PBF  [LT-UF-24_N]

### Nets
+3V3_UNSWITCHED: C8.2 R12.1 R13.1 U4.10(VOUT1)
+VOUT: C6.2 C7.2 L1.2 U4.9(VIN1) U4.20(VOUT)
+VUSB: C5.2 R8.2 R10.1 R11.1 R14.1 R16.1 R17.1 U4.21(VBUS)
GND: C5.1 C6.1 C7.1 C8.1 C12.2 C13.2 P1.2 R9.1 R10.3 R11.3 R14.3 R16.3 R17.3 R18.2 R19.2 R20.2 U4.6(GND) U4.12(GND) U4.17(GND) U4.25(EP)
VBAT: P1.1 U4.19(BAT)
PMIC_~{CHRG}: U4.16(~{CHRG})
PMIC_~{CHRGEN}: R10.2 U4.23(~{CHRGEN})
PMIC_CLPROG: C12.1 R18.1 U4.2(CLPROG)
PMIC_EN1: R17.2 U4.24(EN1)
PMIC_FB1: C10.2 C11.1 R13.2 R15.2 R20.1 U4.4(FB1)
PMIC_ILIM0: R14.2 U4.13(ILIM0)
PMIC_ILIM1: R11.2 U4.14(ILIM1)
PMIC_MODE: R16.2 U4.8(MODE)
PMIC_PROG: R19.1 U4.15(PROG)
PMIC_VC1: C9.1 C10.1 U4.5(VC1)
NetC9_2: C9.2 R15.1
NetC11_2: C11.2 R12.2
NetC13_1: C13.1 U4.1(LDO3V3)
NetL1_1: L1.1 U4.22(SW)
NetL2_1: L2.1 U4.11(SWCD1)
NetL2_2: L2.2 U4.7(SWAB1)
NetR8_1: R8.1 R9.2 U4.3(NTC)

Not connected (* = marked no-connect by the designer): U4 18(GATE)*

### Notes on the sheet
- LED?
- (near C5) Place NTC close to battery
- 0Ω Pull-Up Resistor
- 0Ω Pull-Down Resistor
- Labels drawn without touching a wire or pin: PMIC_~{CHRG}

### Library data of the parts
BAT1 = PRT-00339: Polymer Lithium Ion Battery - 1000mAh
C5-C13 = CPN_SMT: as C1 on sheet ExternalConnections
  C5: Value: 10µF
  C6 C8: Value: 22µF
  C7: Value: 2.2µF
  C9: Value: 330pF
  C10: Value: 10pF
  C11: Value: 33pF
  C12 C13: Value: 0.1µF
L1 = Wurth 744043003: FIXED IND 3.3UH 2.15A 35 MOHM; Manufacturer: Wurth Electronics Inc; Type: Wirewound; Material - Core: Ferrite; Tolerance: ±30%; Current - Saturation: 1.8A; Shielding: Shielded; DC Resistance (DCR): 35 mOhm Max; Frequency - Self Resonant: 80MHz; Frequency - Test: 100kHz; Supplier 1: Digi-Key; Manufacturer Part Number: 744043003; RoHS: RoHS Compliant; Category: Inductors, Coils, Chokes; Stock 1: 3734; Pricing 1: 1=1.63, 10=1.55, 50=1.4726, 100=1.3563, 250=1.27876 (USD); Packaging: Cut Tape (CT); Current Rating: 2.15A; Q @ Freq: -; Ratings: -; Operating Temperature: -40°C ~ 125°C; Mounting Type: Surface Mount; Package / Case: 1919 (4848 Metric); Size / Dimension: 0.189" L x 0.189" W (4.80mm x 4.80mm); Height - Seated (Max): 0.118" (3.00mm); ComponentLink1URL: http://katalog.we-online.de/pbs/datasheet/744043003.pdf; ComponentLink1Description: http://katalog.we-online.de/pbs/datasheet/744043003.pdf; Supplier Part Number 1: 732-1097-1-ND
L2 = Wurth 7440430022: FIXED IND 2.2UH 2.5A 28 MOHM SMD; Manufacturer: Wurth Electronics Inc; Type: Wirewound; Material - Core: Ferrite; Tolerance: ±30%; Current - Saturation: 2.35A; Shielding: Shielded; DC Resistance (DCR): 28 mOhm Max; Frequency - Self Resonant: 100MHz; Frequency - Test: 100kHz; Supplier 1: Digi-Key; Manufacturer Part Number: 7440430022; RoHS: RoHS Compliant; Category: Inductors, Coils, Chokes; Stock 1: 12343; Pricing 1: 1=1.63, 10=1.55, 50=1.4726, 100=1.3563, 250=1.27876 (USD); Packaging: Cut Tape (CT); Current Rating: 2.5A; Q @ Freq: -; Ratings: -; Operating Temperature: -40°C ~ 125°C; Mounting Type: Surface Mount; Package / Case: 1919 (4848 Metric); Size / Dimension: 0.189" L x 0.189" W (4.80mm x 4.80mm); Height - Seated (Max): 0.118" (3.00mm); ComponentLink1URL: http://katalog.we-online.de/pbs/datasheet/7440430022.pdf; ComponentLink1Description: http://katalog.we-online.de/pbs/datasheet/7440430022.pdf; Supplier Part Number 1: 732-1095-1-ND
P1 = Header 2: Header, 2-Pin
R8 R12 R13 R15 R18-R20 = RES_SMT: SMT resistor; Tolerance: 1%
  R8: Value: 100kΩ
  R12: Value: 121kΩ
  R13: Value: 324kΩ
  R15: Value: 15kΩ
  R18: Value: 3.01kΩ
  R19: Value: 2kΩ
  R20: Value: 105kΩ
R9 = Vishay NTCS0805E3104FXT: THERMISTOR NTC 100K OHM 1% 0805; Manufacturer: Vishay BC Components; B25/85: 4100K; Power - Max: 210mW; Supplier 1: Digi-Key; Manufacturer Part Number: NTCS0805E3104FXT; RoHS: RoHS Compliant; Category: Sensors, Transducers; Stock 1: 17485; Pricing 1: 1=0.6, 10=0.409, 50=0.385, 100=0.3429, 250=0.33684, 500=0.3188, 1000=0.30677 (USD); Packaging: Cut Tape (CT); Resistance Tolerance: ±1%; B Value Tolerance: ±1%; B0/50: -; B25/50: -; B25/75: -; B25/100: -; Operating Temperature: -40°C ~ 150°C; Length - Lead Wire: -; Mounting Type: Surface Mount; Package / Case: 0805 (2012 Metric); ComponentLink1URL: http://www.vishay.com/docs/29044/ntcs0805e3t.pdf; ComponentLink1Description: http://www.vishay.com/docs/29044/ntcs0805e3t.pdf; Supplier Part Number 1: BC2562CT-ND
R10 R11 R14 R16 R17 = RES_SMT_NONPOP: SMT resistor; Tolerance: 1%; Value: 0
U4 = LTC3566EUF#PBF: High Efficiency USB Power Manager Plus 1 A Buck-Boost Converter, 4.35 to 5.5 V Vin, 24-pin QFN (UF-24), -40 to 85 degC, Pb-Free; Manufacturer: Linear Technology; Number of Cells: 1; Vin Max(V): 5.5; Vin Min(V): 4.35; DatasheetVersion: Rev. B; PackageVersion: Rev. B, 02/2012; PackageReference: UF24; PackageDescription: 24-Pin Plastic QFN, Body 4 x 4 mm, Pitch 0.5 mm; Supplier 1: Digi-Key; Supplier Part Number 1: LTC3566EUF#PBF-ND; Supplier 2: Farnell; Supplier Part Number 2: 1628881; Supplier 3: Newark; Supplier Part Number 3: 95M6504; Number of Outputs: 1; RoHS: TRUE; Mounting Technology: Surface Mount; Code_JEDEC: MO-220; PartNumber: LTC3566EUF#PBF; ComponentLink1Description: Manufacturer URL; ComponentLink1URL: http://www.linear.com/; ComponentLink2Description: Datasheet; ComponentLink2URL: http://cds.linear.com/docs/en/datasheet/3566fb.pdf; ComponentLink3Description: Package Specification; ComponentLink3URL: http://cds.linear.com/docs/en/packaging/%28UF24%29%20QFN%2005-08-1697%20Rev%20B.pdf

## Nets that join several sheets
+3V3_UNSWITCHED: ExternalConnections (SW1.2), Power (C8.2 R12.1 R13.1 U4.10)
+VUSB: ExternalConnections (F1.2), Power (8 pins)
GND: ExternalConnections (30 pins), USB (22 pins), Power (20 pins)
~{RESET}_Button: ExternalConnections (5 pins), USB (U5.4 U7.11)
USB_N: ExternalConnections (J1.2), USB (R21.1 U6.2)
USB_P: ExternalConnections (J1.3), USB (R22.1 U6.1)